# Altium project RcMPPT-SCC.PrjPcb
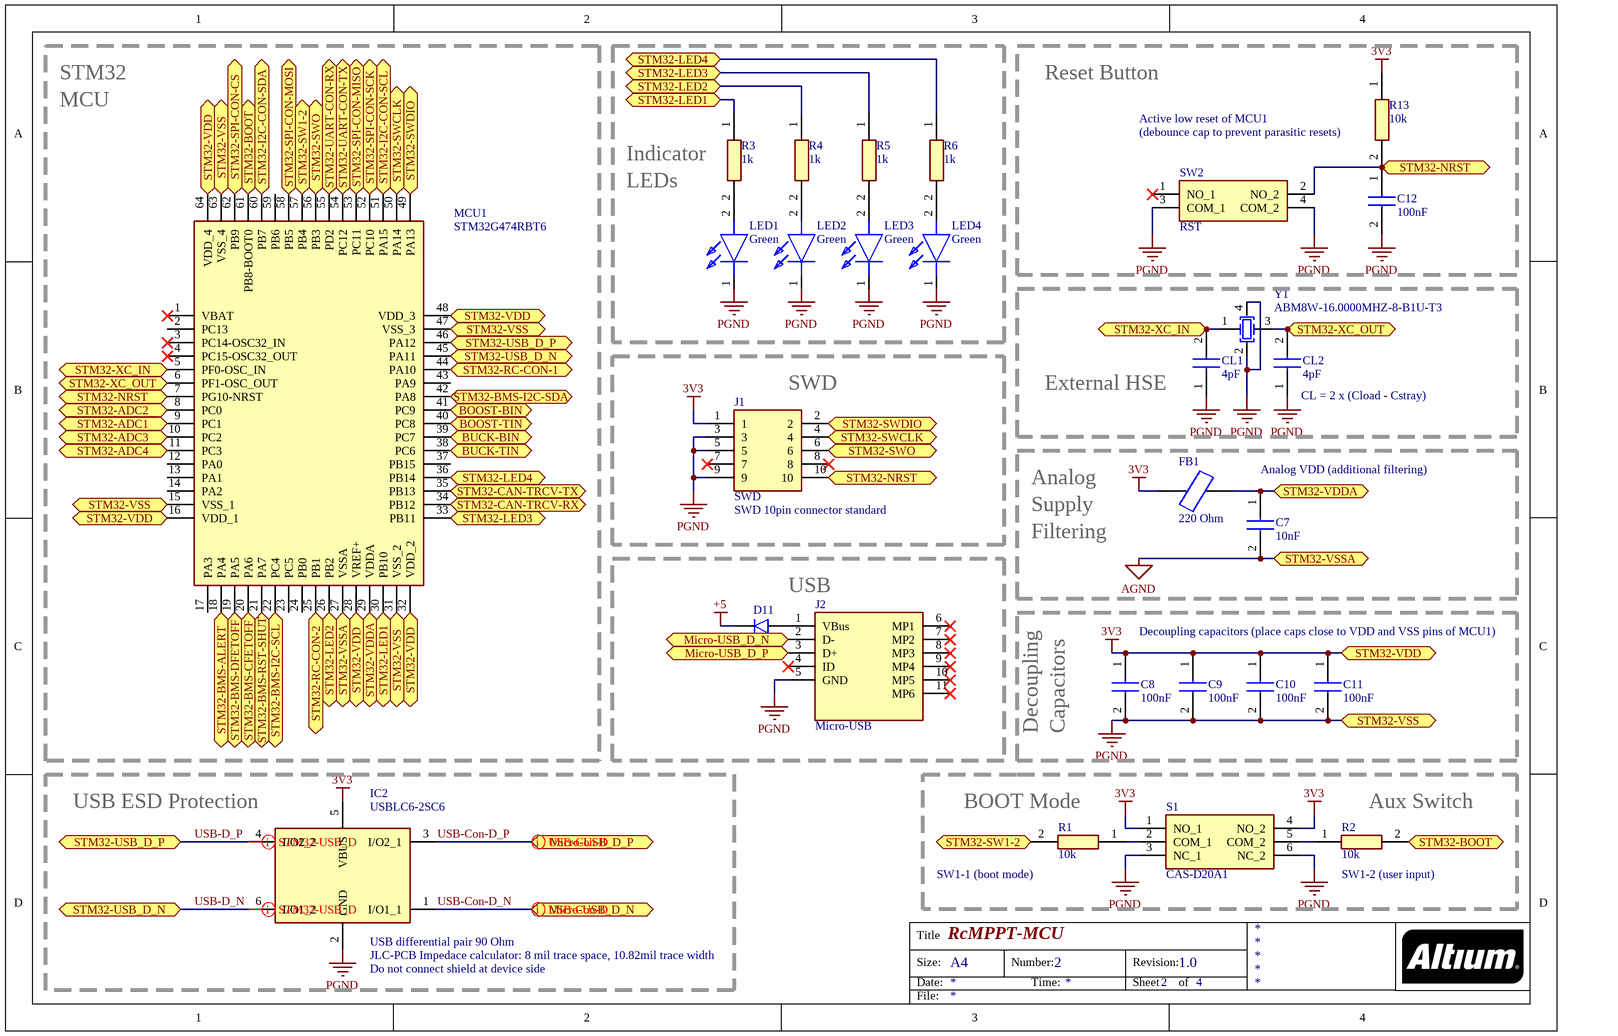
[diagram p0: RcMPPT-MCU.SchDoc]
4 sheets, 115 parts. Net scope: flat (ports and power ports of the same name join across sheets).
Board file: RcMPPT-SCC.PcbDoc
Sheets:
  RcMPPT-MCU.SchDoc
  RcMPPT-Power_Module.SchDoc
  RcMPPT-DCDC.SchDoc
  RcMPPT-IO.SchDoc

## Sheet RcMPPT-MCU.SchDoc: RcMPPT-MCU
size A4; Author: Thomas Hofmann; DocumentNumber: 2; Revision: 1.0; SheetNumber: 2; SheetTotal: 4

### Parts
C7  10nF  [CAPC2012X88N]
C8  100nF  [CAPC1608X97N]
C9  100nF  [CAPC1608X97N]
C10  100nF  [CAPC1608X97N]
C11  100nF  [CAPC1608X97N]
C12  100nF  [CAPC1608X97N]
CL1  4pF  [CAPC1608X90N]
CL2  4pF  [CAPC1608X90N]
D11  BAS3010A03WE6327HTSA1  [SOD2513X110N]  (value not drawn)
FB1  220 Ohm  [BEADC1608X75N]
IC2  USBLC6-2SC6  [SOT95P280X145-6N]
J1  SWD  [HUSSP10W40P127_2X5_635X340X420P]
J2  Micro-USB  [19815841]
LED1  Green  [LGQ396PS35]
LED2  Green  [LGQ396PS35]
LED3  Green  [LGQ396PS35]
LED4  Green  [LGQ396PS35]
MCU1  STM32G474RBT6  [QFP50P1200X1200X160-64N]
R1  10k  [RESC1608X55N]
R2  10k  [RESC1608X55N]
R3  1k  [RESC1608X55N]
R4  1k  [RESC1608X55N]
R5  1k  [RESC1608X55N]
R6  1k  [RESC1608X55N]
R13  10k  [RESC1608X55N]
S1  CAS-D20A1  [CASD20A1]
SW2  RST  [PTS647SK38SMTR2LFS]
Y1  ABM8W-16.0000MHZ-8-B1U-T3  [ABM8W160000MHZ8B1UT3]

### Blocks framed on the sheet
Reset Button: C12 R13 SW2
External HSE: CL1 CL2 Y1
SWD: J1
USB: D11 J2
USB ESD Protection: IC2

### Ports
BOOST-BIN (bidir), BOOST-TIN (bidir), BUCK-BIN (bidir), BUCK-TIN (bidir), Micro-USB_D_N (bidir), Micro-USB_D_P (bidir), STM32-ADC1 (bidir), STM32-ADC2 (bidir), STM32-ADC3 (bidir), STM32-ADC4 (bidir), STM32-BMS-ALERT (bidir), STM32-BMS-CFETOFF (bidir), STM32-BMS-DFETOFF (bidir), STM32-BMS-I2C-SCL (bidir), STM32-BMS-I2C-SDA (bidir), STM32-BMS-RST-SHUT (bidir), STM32-BOOT (bidir), STM32-CAN-TRCV-RX (bidir), STM32-CAN-TRCV-TX (bidir), STM32-I2C-CON-SCL (bidir), STM32-I2C-CON-SDA (bidir), STM32-LED1 (bidir), STM32-LED2 (bidir), STM32-LED3 (bidir), STM32-LED4 (bidir), STM32-NRST (bidir), STM32-RC-CON-1 (bidir), STM32-RC-CON-2 (bidir), STM32-SPI-CON-CS (bidir), STM32-SPI-CON-MISO (bidir), STM32-SPI-CON-MOSI (bidir), STM32-SPI-CON-SCK (bidir), STM32-SW1-2 (bidir), STM32-SWCLK (bidir), STM32-SWDIO (bidir), STM32-SWO (bidir), STM32-UART-CON-RX (bidir), STM32-UART-CON-TX (bidir), STM32-USB_D_N (bidir), STM32-USB_D_P (bidir), STM32-VDD (bidir), STM32-VDDA (bidir), STM32-VSS (bidir), STM32-VSSA (bidir), STM32-XC_IN (bidir), STM32-XC_OUT (bidir)

### Nets
3V3: C8.1 C9.1 C10.1 C11.1 FB1.1 IC2.5(VBUS) J1.1 MCU1.16(VDD_1) MCU1.28(VREF+) MCU1.32(VDD_2) MCU1.48(VDD_3) MCU1.64(VDD_4) R13.1 S1.1(NO_1) S1.4(NO_2) ; port STM32-VDD
+5: D11.1(K)
AGND: C7.2 MCU1.27(VSSA) ; port STM32-VSSA
PGND: C8.2 C9.2 C10.2 C11.2 C12.2 CL1.1 CL2.1 IC2.2(GND) J1.3 J1.5 J1.9 J2.5(GND) LED1.1(K) LED2.1(K) LED3.1(K) LED4.1(K) MCU1.15(VSS_1) MCU1.31(VSS_2) MCU1.47(VSS_3) MCU1.63(VSS_4) S1.3(NC_1) S1.6(NC_2) SW2.3(COM_1) SW2.4(COM_2) Y1.2(OSC2) Y1.4 ; port STM32-VSS
BOOST-BIN: MCU1.41(PC9) ; port BOOST-BIN
BOOST-TIN: MCU1.40(PC8) ; port BOOST-TIN
BUCK-BIN: MCU1.39(PC7) ; port BUCK-BIN
BUCK-TIN: MCU1.38(PC6) ; port BUCK-TIN
STM32-ADC1: MCU1.9(PC1) ; port STM32-ADC1
STM32-ADC2: MCU1.8(PC0) ; port STM32-ADC2
STM32-ADC3: MCU1.10(PC2) ; port STM32-ADC3
STM32-ADC4: MCU1.11(PC3) ; port STM32-ADC4
STM32-BMS-ALERT: MCU1.18(PA4) ; port STM32-BMS-ALERT
STM32-BMS-CFETOFF: MCU1.20(PA6) ; port STM32-BMS-CFETOFF
STM32-BMS-DFETOFF: MCU1.19(PA5) ; port STM32-BMS-DFETOFF
STM32-BMS-I2C-SCL: MCU1.22(PC4) ; port STM32-BMS-I2C-SCL
STM32-BMS-I2C-SDA: MCU1.42(PA8) ; port STM32-BMS-I2C-SDA
STM32-BMS-RST-SHUT: MCU1.21(PA7) ; port STM32-BMS-RST-SHUT
STM32-BOOT: MCU1.61(PB8-BOOT0) R2.2 ; port STM32-BOOT
STM32-CAN-TRCV-RX: MCU1.34(PB12) ; port STM32-CAN-TRCV-RX
STM32-CAN-TRCV-TX: MCU1.35(PB13) ; port STM32-CAN-TRCV-TX
STM32-I2C-CON-SCL: MCU1.51(PA15) ; port STM32-I2C-CON-SCL
STM32-I2C-CON-SDA: MCU1.60(PB7) ; port STM32-I2C-CON-SDA
STM32-LED1: MCU1.30(PB10) R3.1 ; port STM32-LED1
STM32-LED2: MCU1.26(PB2) R4.1 ; port STM32-LED2
STM32-LED3: MCU1.33(PB11) R5.1 ; port STM32-LED3
STM32-LED4: MCU1.36(PB14) R6.1 ; port STM32-LED4
STM32-NRST: C12.1 J1.10 MCU1.7(PG10-NRST) R13.2 SW2.2(NO_2) ; port STM32-NRST
STM32-RC-CON-1: MCU1.44(PA10) ; port STM32-RC-CON-1
STM32-RC-CON-2: MCU1.25(PB1) ; port STM32-RC-CON-2
STM32-SPI-CON-CS: MCU1.62(PB9) ; port STM32-SPI-CON-CS
STM32-SPI-CON-MISO: MCU1.53(PC11) ; port STM32-SPI-CON-MISO
STM32-SPI-CON-MOSI: MCU1.58(PB5) ; port STM32-SPI-CON-MOSI
STM32-SPI-CON-SCK: MCU1.52(PC10) ; port STM32-SPI-CON-SCK
STM32-SW1-2: MCU1.57(PB4) R1.2 ; port STM32-SW1-2
STM32-SWCLK: J1.4 MCU1.50(PA14) ; port STM32-SWCLK
STM32-SWDIO: J1.2 MCU1.49(PA13) ; port STM32-SWDIO
STM32-SWO: J1.6 MCU1.56(PB3) ; port STM32-SWO
STM32-UART-CON-RX: MCU1.55(PD2) ; port STM32-UART-CON-RX
STM32-UART-CON-TX: MCU1.54(PC12) ; port STM32-UART-CON-TX
STM32-VDDA: C7.1 FB1.2 MCU1.29(VDDA) ; port STM32-VDDA
STM32-XC_IN: CL1.2 MCU1.5(PF0-OSC_IN) Y1.1(OSC1) ; port STM32-XC_IN
STM32-XC_OUT: CL2.2 MCU1.6(PF1-OSC_OUT) Y1.3 ; port STM32-XC_OUT
USB-Con-D_N: IC2.1(I/O1_1) J2.2(D-) ; port Micro-USB_D_N
USB-Con-D_P: IC2.3(I/O2_1) J2.3(D+) ; port Micro-USB_D_P
USB-D_N: IC2.6(I/O1_2) MCU1.45(PA11) ; port STM32-USB_D_N
USB-D_P: IC2.4(I/O2_2) MCU1.46(PA12) ; port STM32-USB_D_P
NetD11_2: D11.2(A) J2.1(VBus)
NetLED1_2: LED1.2(A) R3.2
NetLED2_2: LED2.2(A) R4.2
NetLED3_2: LED3.2(A) R5.2
NetLED4_2: LED4.2(A) R6.2
NetR1_1: R1.1 S1.2(COM_1)
NetR2_1: R2.1 S1.5(COM_2)

Not connected (* = marked no-connect by the designer): J1 7* 8*; J2 4(ID)* 6(MP1)* 7(MP2)* 8(MP3)* 9(MP4)* 10(MP5)* 11(MP6)*; MCU1 1(VBAT)* 2(PC13) 3(PC14-OSC32_IN)* 4(PC15-OSC32_OUT)* 12(PA0) 13(PA1) 14(PA2) 17(PA3) 23(PC5) 24(PB0) 37(PB15) 43(PA9) 59(PB6); SW2 1(NO_1)*

### Layout directives
differential pair; rule Differential Pairs Routing [Pref Gap = 10mil    Min Gap  = 8mil    Max Gap  = 10milPref Width = 15mil    Min Width  = 10.28mil    Max Width  = 15mil]: USB-Con-D_N, USB-Con-D_P, USB-D_N, USB-D_P

### Notes on the sheet
- STM32
- MCU
- (near R3) Indicator
- Active low reset of MCU1
- (near R13) (debounce cap to prevent parasitic resets)
- LEDs
- (near CL2) CL = 2 x (Cload - Cstray)
- (near J1) SWD 10pin connector standard
- Analog
- Supply
- Analog VDD (additional filtering)
- Filtering
- Decoupling capacitors (place caps close to VDD and VSS pins of MCU1)
- Decoupling
- Capacitors
- (near R1) BOOT Mode
- (near R2) Aux Switch
- (near R1) SW1-1 (boot mode)
- (near R2) SW1-2 (user input)
- (near IC2) USB differential pair 90 Ohm
- (near IC2) JLC-PCB Impedace calculator: 8 mil trace space, 10.82mil trace width
- (near IC2) Do not connect shield at device side
- Title
- Size:
- Date:
- A4
- Number:
- Time:
- Revision:
- Sheet
- of
- File:

### Library data of the parts
C7 = C0805C103J3GACTU: Capacitor; Manufacturer_Name: Kemet; Datasheet Link: https://componentsearchengine.com/Datasheets/2/C0805C103J3GACTU.pdf; Height: 0.88mm; Manufacturer_Part_Number: C0805C103J3GACTU; Arrow Part Number: C0805C103J3GACTU; Arrow Price/Stock: https://www.arrow.com/en/products/c0805c103j3gactu/kemet-corporation; Mouser Part Number: 80-C0805C103J3G; Mouser Price/Stock: https://www.mouser.co.uk/ProductDetail/KEMET/C0805C103J3GACTU?qs=K%2Fj%2Fqf%252B0fqJFcB%2FiaHub0Q%3D%3D
C8-C12 = VJ0603Y104JXJAC: Capacitor; Manufacturer_Name: Vishay; Datasheet Link: http://www.vishay.com/docs/45226/vj31xrohsautomlcc.pdf; Height: 0.97mm; Manufacturer_Part_Number: VJ0603Y104JXJAC; Mouser Part Number: 77-VJ0603Y104JXJAC; Mouser Price/Stock: https://www.mouser.com/Search/Refine.aspx?Keyword=77-VJ0603Y104JXJAC
CL1 CL2 = CL10C040CB8NNNC: Capacitor; Manufacturer_Name: Samsung Electro-Mechanics; Datasheet Link: https://datasheet.lcsc.com/szlcsc/Samsung-Electro-Mechanics-CL10C040CB8NNNC_C307494.pdf; Height: 0.9mm; Manufacturer_Part_Number: CL10C040CB8NNNC; Mouser Part Number: N/A; Mouser Price/Stock: https://www.mouser.co.uk/ProductDetail/Samsung-Electro-Mechanics/CL10C040CB8NNNC?qs=X6jEic%2FHinCXvSxHicvHqA%3D%3D; Arrow Part Number: CL10C040CB8NNNC; Arrow Price/Stock: https://www.arrow.com/en/products/cl10c040cb8nnnc/samsung-electro-mechanics
D11 = BAS3010A03WE6327HTSA1: Diode; Manufacturer_Name: Infineon; Datasheet Link: https://www.infineon.com/dgdl/Infineon-BAS3010ASERIES-DS-v01_01-en.pdf?fileId=db3a30431ddc9372011dfbc50f231c06; Height: 1.1mm; Manufacturer_Part_Number: BAS3010A03WE6327HTSA1; Arrow Part Number: BAS3010A03WE6327HTSA1; Arrow Price/Stock: https://www.arrow.com/en/products/bas3010a03we6327htsa1/infineon-technologies-ag; Mouser Part Number: 726-BAS3010A-03WE6; Mouser Price/Stock: https://www.mouser.co.uk/ProductDetail/Infineon-Technologies/BAS3010A03WE6327HTSA1?qs=K00xGehIljtEbk1%252B2pLZ%252BQ%3D%3D
FB1 = MPZ1608S221ATA00: Ferrite Bead; Manufacturer_Name: TDK; Datasheet Link: https://product.tdk.com/info/en/catalog/datasheets/beads_commercial_power_mpz1608_en.pdf; Height: 0.75mm; Manufacturer_Part_Number: MPZ1608S221ATA00; Mouser Part Number: 810-MPZ1608S221ATA00; Mouser Price/Stock: https://www.mouser.co.uk/ProductDetail/TDK/MPZ1608S221ATA00/?qs=pLY5GE0xrmLZeKkazChaNg%3D%3D; Arrow Part Number: MPZ1608S221ATA00; Arrow Price/Stock: https://www.arrow.com/en/products/mpz1608s221ata00/tdk
IC2 = USBLC6-2SC6: Integrated Circuit; Manufacturer_Name: STMicroelectronics; Datasheet Link: http://www.st.com/st-web-ui/static/active/en/resource/technical/document/datasheet/CD00050750.pdf; Height: 1.45mm; Manufacturer_Part_Number: USBLC6-2SC6; Arrow Part Number: USBLC6-2SC6; Arrow Price/Stock: https://www.arrow.com/en/products/usblc6-2sc6/stmicroelectronics; Mouser Part Number: 511-USBLC6-2SC6; Mouser Price/Stock: https://www.mouser.co.uk/ProductDetail/STMicroelectronics/USBLC6-2SC6?qs=po45yt2pPpu%2FhNIlwQdTlg%3D%3D
J1 = M50-3600542R: Connector; Manufacturer_Name: Harwin; Datasheet Link: https://cdn.harwin.com/pdfs/M50-360R.pdf; Manufacturer_Part_Number: M50-3600542R; Mouser Part Number: 855-M50-3600542R; Mouser Price/Stock: https://www.mouser.co.uk/ProductDetail/Harwin/M50-3600542R?qs=DVxm2sPGGrrPu%2FxuhpV3yw%3D%3D
J2 = 1981584-1: Connector; Manufacturer_Name: TE Connectivity; Datasheet Link: http://www.te.com/commerce/DocumentDelivery/DDEController?Action=showdoc&DocId=Customer+Drawing%7F1981584%7FD2%7Fpdf%7FEnglish%7FENG_CD_1981584_D2.pdf%7F1981584-1; Height: 3mm; Manufacturer_Part_Number: 1981584-1; Arrow Part Number: 1981584-1; Arrow Price/Stock: https://www.arrow.com/en/products/1981584-1/te-connectivity; Mouser Part Number: 571-1981584-1; Mouser Price/Stock: https://www.mouser.co.uk/ProductDetail/TE-Connectivity/1981584-1?qs=ozkTL%2FUej0TLYxjQLPnd2Q%3D%3D
LED1-LED4 = LG_Q396-PS-35: LED; Manufacturer_Name: OSRAM; Manufacturer_Part_Number: LG Q396-PS-35; Datasheet Link: https://mouser.componentsearchengine.com/Datasheets/2/LG%20Q396-PS-35.pdf; Height: 0.4mm; Arrow Part Number: LG Q396-PS-35; Arrow Price/Stock: https://www.arrow.com/en/products/lgq396-ps-35/osram-opto-semiconductors; Mouser Part Number: 720-LGQ396A3964; Mouser Price/Stock: https://www.mouser.co.uk/ProductDetail/OSRAM-Opto-Semiconductors/LG-Q396-PS-35?qs=xC%252BE9h5iuX5%252BCocujXxOpw%3D%3D
MCU1 = STM32G474RBT6: Integrated Circuit; Manufacturer_Name: STMicroelectronics; Datasheet Link: https://www.mouser.com/datasheet/2/389/stm32g474cb-1600828.pdf; Height: 1.6mm; Manufacturer_Part_Number: STM32G474RBT6; Mouser Part Number: 511-STM32G474RBT6; Mouser Price/Stock: https://www.mouser.co.uk/ProductDetail/STMicroelectronics/STM32G474RBT6?qs=uwxL4vQweFP0uAZUZXLBhQ%3D%3D
R1 R2 R13 = MCT06030C1002FP500: Resistor; Manufacturer_Name: Vishay; Datasheet Link: http://www.vishay.com/docs/28705/mcx0x0xpro.pdf; Height: 0.55mm; Manufacturer_Part_Number: MCT06030C1002FP500; Mouser Part Number: 594-MCT06030C1002FP5; Mouser Price/Stock: https://www.mouser.co.uk/ProductDetail/Vishay-Beyschlag/MCT06030C1002FP500?qs=Wvg1umJc15zoHgIjwqoGHw%3D%3D
R3-R6 = MCT06030C1001FP500: Resistor; Manufacturer_Name: Vishay; Datasheet Link: http://www.vishay.com/docs/28705/mcx0x0xpro.pdf; Height: 0.55mm; Manufacturer_Part_Number: MCT06030C1001FP500; Mouser Part Number: 594-MCT06030C1001FP5; Mouser Price/Stock: https://www.mouser.co.uk/ProductDetail/Vishay-Beyschlag/MCT06030C1001FP500?qs=7ZE6F4QMOBbsjeUdqW8cwA%3D%3D
S1 = CAS-D20A1: Switch; Manufacturer_Name: Copal Electronics; Datasheet Link: https://www.nidec-copal-electronics.com/e/catalog/switch/cas.pdf; Height: 2.5mm; Manufacturer_Part_Number: CAS-D20A1
SW2 = PTS_647_SK38_SMTR2_LFS: Switch; Manufacturer_Name: C & K COMPONENTS; Manufacturer_Part_Number: PTS 647 SK38 SMTR2 LFS; Datasheet Link: https://dznh3ojzb2azq.cloudfront.net/products/Tactile/PTS647/documents/datasheet.pdf; Height: 3.8mm; Arrow Part Number: PTS 647 SK38 SMTR2 LFS; Arrow Price/Stock: https://www.arrow.com/en/products/pts-647-sk38-smtr2-lfs/ck
Y1 = ABM8W-16.0000MHZ-8-B1U-T3: Crystal or Oscillator; Manufacturer_Name: ABRACON; Datasheet Link: https://abracon.com/Resonators/ABM8W.pdf; Height: 0.75mm; Manufacturer_Part_Number: ABM8W-16.0000MHZ-8-B1U-T3; Mouser Part Number: 815-8W16-8B1UT; Mouser Price/Stock: https://www.mouser.co.uk/ProductDetail/ABRACON/ABM8W-160000MHZ-8-B1U-T3?qs=5aG0NVq1C4zuwTHNFUIcqw%3D%3D; Arrow Part Number: ABM8W-16.0000MHZ-8-B1U-T3; Arrow Price/Stock: https://www.arrow.com/en/products/abm8w-16.0000mhz-8-b1u-t3/abracon

## Sheet RcMPPT-Power_Module.SchDoc: RcMPPT-Power_Module
size A4; Author: Thomas Hofmann; DocumentNumber: 1; Revision: 1.0; SheetNumber: 1; SheetTotal: 4
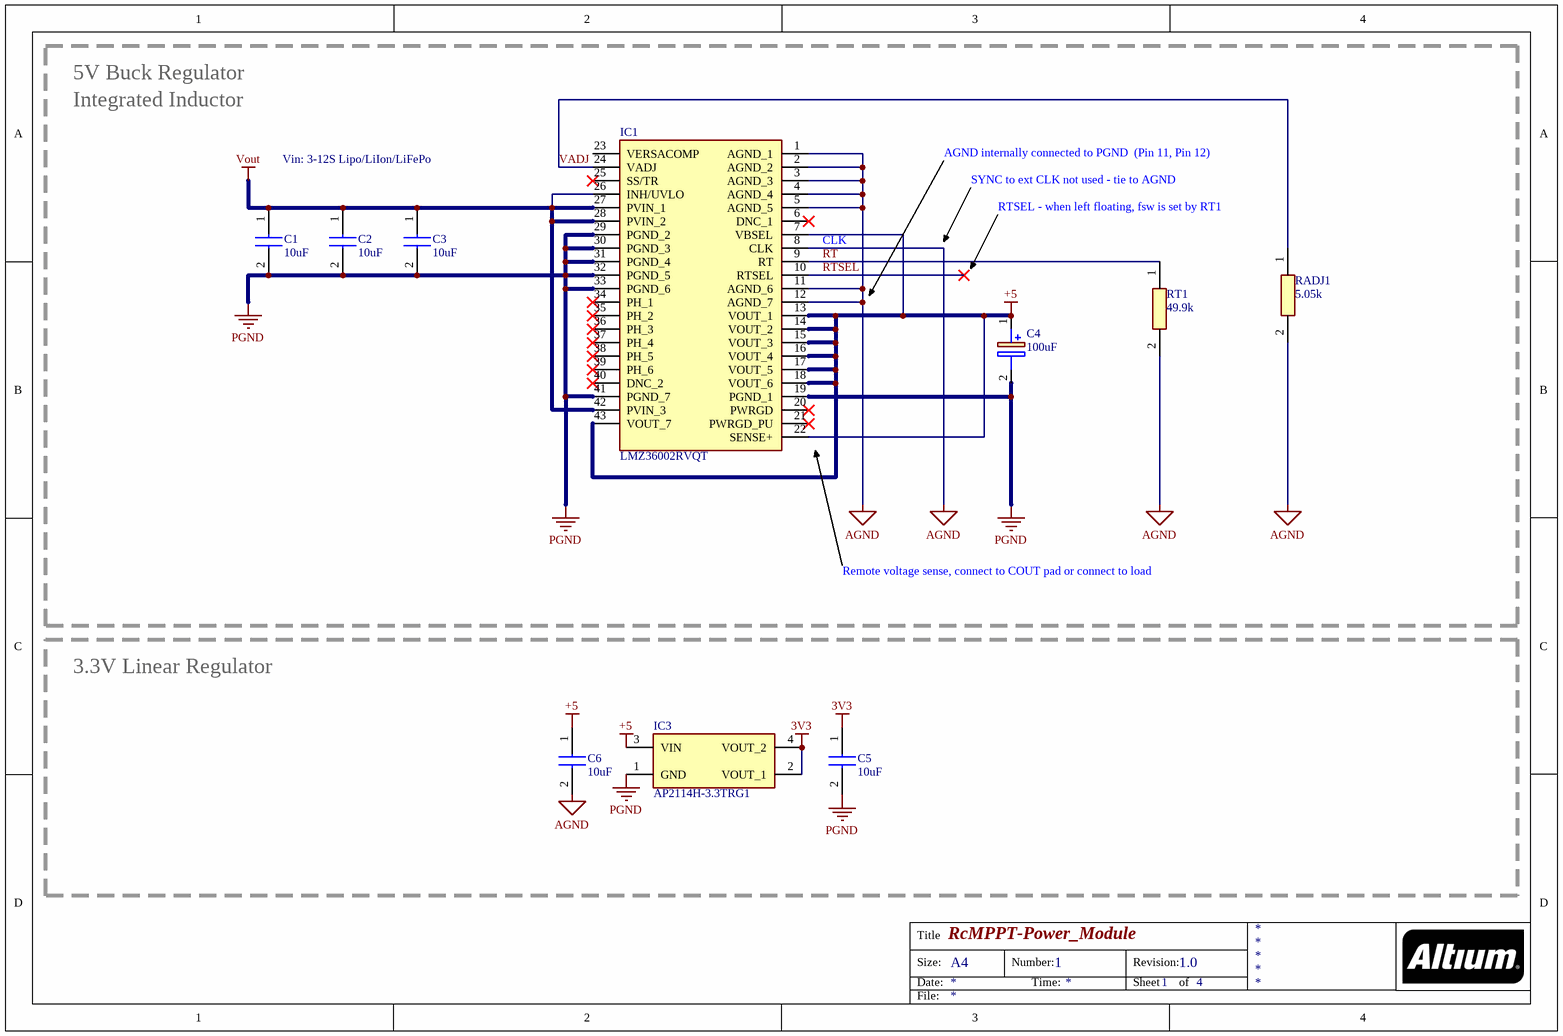
[diagram p1: RcMPPT-Power_Module.SchDoc]

### Parts
C1  10uF  [CAPC3225X280N]
C2  10uF  [CAPC3225X280N]
C3  10uF  [CAPC3225X280N]
C4  100uF  [CAPPM3528X200N]
C5  10uF  [CAPC3225X280N]
C6  10uF  [CAPC3225X280N]
IC1  LMZ36002RVQT  [LMZ36002RVQR]
IC3  AP2114H-3.3TRG1  [SOT230P700X180-4N]
RADJ1  5.05k  [R0805]
RT1  49.9k  [R0805]

### Blocks framed on the sheet
3.3V Linear Regulator: C5 C6 IC3

### Nets
3V3: C5.1 IC3.2(VOUT_1) IC3.4(VOUT_2)
+5: C4.1(+) C6.1 IC1.7(VBSEL) IC1.13(VOUT_1) IC1.14(VOUT_2) IC1.15(VOUT_3) IC1.16(VOUT_4) IC1.17(VOUT_5) IC1.18(VOUT_6) IC1.22(SENSE+) IC1.43(VOUT_7) IC3.3(VIN)
AGND: C6.2 IC1.1(AGND_1) IC1.2(AGND_2) IC1.3(AGND_3) IC1.4(AGND_4) IC1.5(AGND_5) IC1.8(CLK) IC1.11(AGND_6) IC1.12(AGND_7) RADJ1.2 RT1.2
PGND: C1.2 C2.2 C3.2 C4.2(-) C5.2 IC1.19(PGND_1) IC1.29(PGND_2) IC1.30(PGND_3) IC1.31(PGND_4) IC1.32(PGND_5) IC1.33(PGND_6) IC1.41(PGND_7) IC3.1(GND)
Vout: C1.1 C2.1 C3.1 IC1.26(INH/UVLO) IC1.27(PVIN_1) IC1.28(PVIN_2) IC1.42(PVIN_3)
RT: IC1.9(RT) RT1.1
RTSEL: IC1.10(RTSEL)
VADJ: IC1.24(VADJ) RADJ1.1

Not connected (* = marked no-connect by the designer): IC1 6(DNC_1)* 20(PWRGD)* 21(PWRGD_PU)* 23(VERSACOMP) 25(SS/TR)* 34(PH_1)* 35(PH_2)* 36(PH_3)* 37(PH_4)* 38(PH_5)* 39(PH_6)* 40(DNC_2)*

### Notes on the sheet
- 5V Buck Regulator
- Integrated Inductor
- Vin: 3-12S Lipo/LiIon/LiFePo
- AGND internally connected to PGND  (Pin 11, Pin 12)
- (near IC1) CLK
- SYNC to ext CLK not used - tie to AGND
- RTSEL - when left floating, fsw is set by RT1
- Remote voltage sense, connect to COUT pad or connect to load
- Title
- Size:
- Date:
- A4
- Number:
- Time:
- Revision:
- Sheet
- of
- File:

### Library data of the parts
C1-C3 C5 C6 = CL32B106KMVNNWE: Capacitor; Manufacturer_Name: Samsung Electro-Mechanics; Datasheet Link: https://www.arrow.com/en/products/cl32b106kmvnnwe/samsung-electro-mechanics; Height: 2.8mm; Manufacturer_Part_Number: CL32B106KMVNNWE; Arrow Part Number: CL32B106KMVNNWE; Arrow Price/Stock: https://www.arrow.com/en/products/cl32b106kmvnnwe/samsung-electro-mechanics; Mouser Part Number: N/A; Mouser Price/Stock: https://www.mouser.co.uk/ProductDetail/Samsung-Electro-Mechanics/CL32B106KMVNNWE?qs=xZ%2FP%252Ba9zWqaEMBbSgKy8gQ%3D%3D
C4 = 8TPE100MAZB: Capacitor Polarised; Manufacturer_Name: Panasonic; Datasheet Link: http://uk.rs-online.com/web/p/products/7887374; Height: 2mm; Manufacturer_Part_Number: 8TPE100MAZB; Arrow Part Number: 8TPE100MAZB; Arrow Price/Stock: https://www.arrow.com/en/products/8tpe100mazb/panasonic; Mouser Part Number: 667-8TPE100MAZB; Mouser Price/Stock: https://www.mouser.co.uk/ProductDetail/Panasonic/8TPE100MAZB?qs=OE1iw1LrrPHKTwwfsidxgA%3D%3D
IC1 = LMZ36002RVQT: Integrated Circuit; Manufacturer_Name: Texas Instruments; Datasheet Link: http://www.ti.com/lit/gpn/lmz36002; Height: 2.13mm; Manufacturer_Part_Number: LMZ36002RVQT; Arrow Part Number: LMZ36002RVQT; Arrow Price/Stock: https://www.arrow.com/en/products/lmz36002rvqt/texas-instruments; Mouser Part Number: 595-LMZ36002RVQT; Mouser Price/Stock: https://www.mouser.co.uk/ProductDetail/Texas-Instruments/LMZ36002RVQT?qs=kFLL9AfgRSBjXTxBMSjGOw%3D%3D
IC3 = AP2114H-3.3TRG1: Integrated Circuit; Manufacturer_Name: Diodes Inc.; Datasheet Link: http://uk.rs-online.com/web/p/products/8283528; Height: 1.8mm; Manufacturer_Part_Number: AP2114H-3.3TRG1; Arrow Part Number: AP2114H-3.3TRG1; Arrow Price/Stock: https://www.arrow.com/en/products/ap2114h-3.3trg1/diodes-incorporated; Mouser Part Number: 621-AP2114H-3.3TRG1; Mouser Price/Stock: https://www.mouser.co.uk/ProductDetail/Diodes-Incorporated/AP2114H-33TRG1?qs=x6A8l6qLYDDSG%2FfwzcsOhw%3D%3D
RADJ1 = RT0805BRD075K05L: Resistor; Manufacturer_Name: Yageo; Datasheet Link: https://www.mouser.at/datasheet/2/447/PYu-RT_1-to-0.01_RoHS_L_11-1669912.pdf; Height: 0.7mm; Manufacturer_Part_Number: RT0805BRD075K05L; Mouser Part Number: 603-RT0805BRD075K05L; Mouser Price/Stock: https://www.mouser.at/ProductDetail/Yageo/RT0805BRD075K05L?qs=bQfrgN9vNvwObDVrZ%2FDM5w%3D%3D
RT1 = ERJ-6ENF4992V: Resistor; Manufacturer_Name: Panasonic; Datasheet Link: https://industrial.panasonic.com/cdbs/www-data/pdf/RDA0000/AOA0000C84.pdf; Height: 0.7mm; Manufacturer_Part_Number: ERJ-6ENF4992V; Mouser Part Number: 667-ERJ-6ENF4992V; Mouser Price/Stock: https://www.mouser.com/Search/Refine.aspx?Keyword=667-ERJ-6ENF4992V

## Sheet RcMPPT-DCDC.SchDoc: RcMPPT-DCDC
size A4; Author: Thomas Hofmann; Address2: HTBLuVA St. Pölten; Address3: Thomas Hofmann; DocumentNumber: 3; Revision: 1.0; SheetNumber: 3; SheetTotal: 4
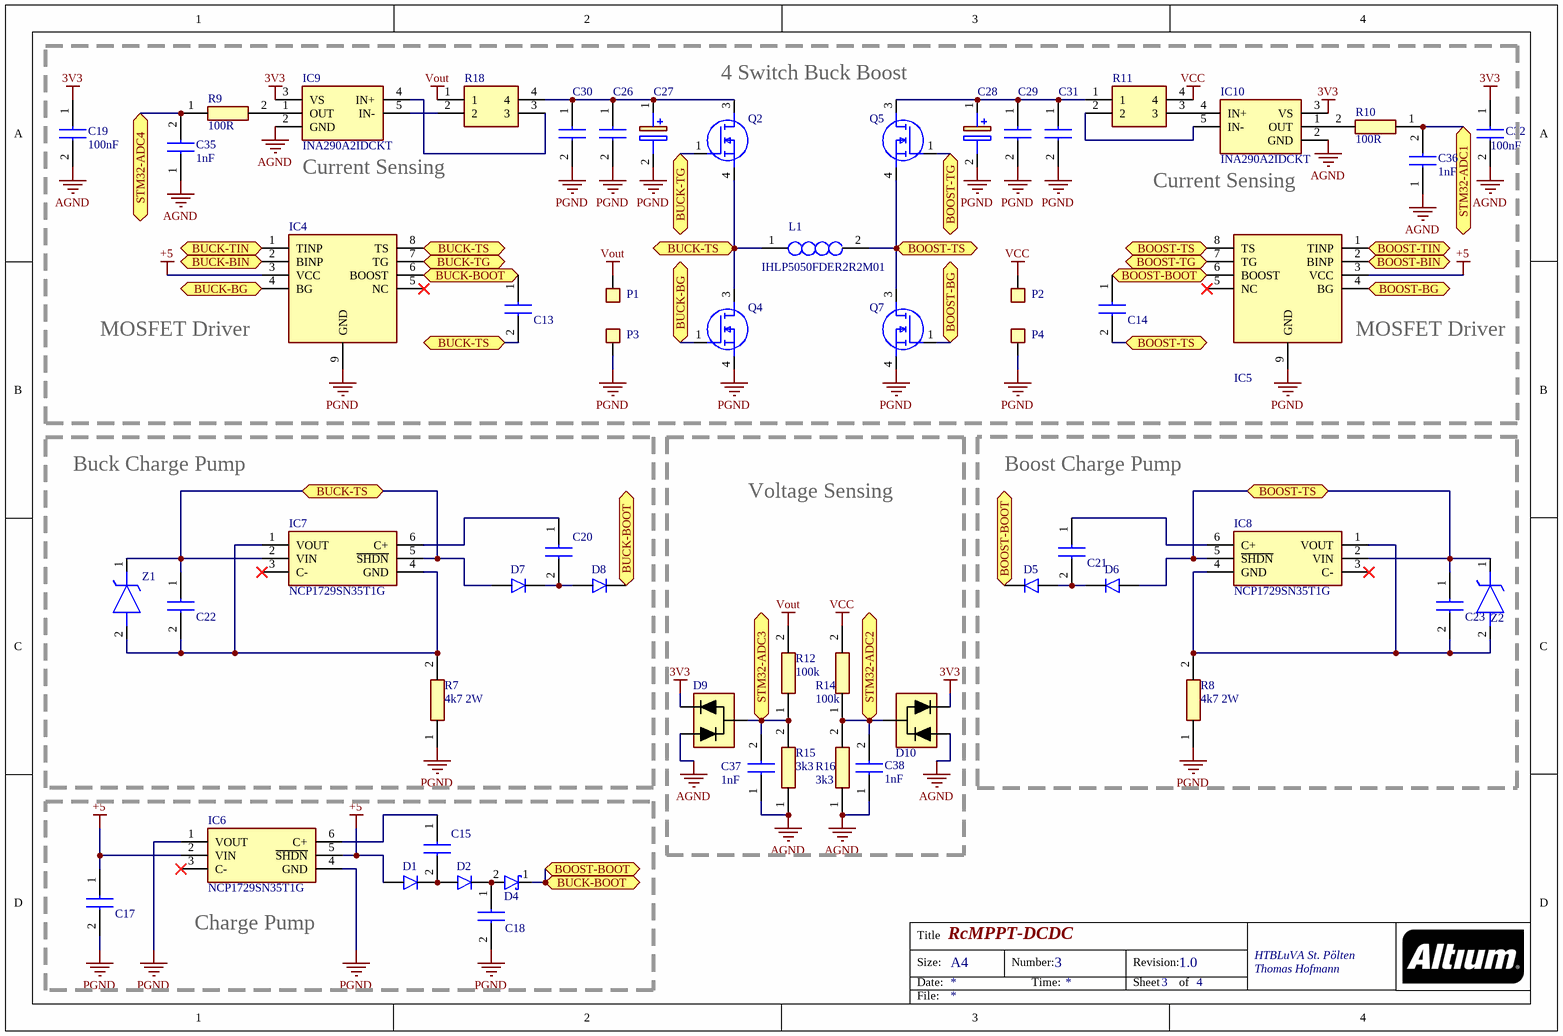
[diagram p2: RcMPPT-DCDC.SchDoc]

### Parts
C13  C1608X5R1E335K080AC  [CAPC1608X90N]  (value not drawn)
C14  C1608X5R1E335K080AC  [CAPC1608X90N]  (value not drawn)
C15  C1608X5R1E335K080AC  [CAPC1608X90N]  (value not drawn)
C17  C1608X5R1E335K080AC  [CAPC1608X90N]  (value not drawn)
C18  C1608X5R1E335K080AC  [CAPC1608X90N]  (value not drawn)
C19  100nF  [CAPC1608X97N]
C20  C1608X5R1E335K080AC  [CAPC1608X90N]  (value not drawn)
C21  C1608X5R1E335K080AC  [CAPC1608X90N]  (value not drawn)
C22  C1608X5R1E335K080AC  [CAPC1608X90N]  (value not drawn)
C23  C1608X5R1E335K080AC  [CAPC1608X90N]  (value not drawn)
C26  GRM32EC72A106KE05L  [CAPC3225X270N]  (value not drawn)
C27  UUX2A470MNL1GS  [CAPAE1030X1050N]  (value not drawn)
C28  UUX2A470MNL1GS  [CAPAE1030X1050N]  (value not drawn)
C29  GRM32EC72A106KE05L  [CAPC3225X270N]  (value not drawn)
C30  GRM32EC72A106KE05L  [CAPC3225X270N]  (value not drawn)
C31  GRM32EC72A106KE05L  [CAPC3225X270N]  (value not drawn)
C32  100nF  [CAPC1608X97N]
C35  1nF  [CAPC1608X90N]
C36  1nF  [CAPC1608X90N]
C37  1nF  [CAPC1608X90N]
C38  1nF  [CAPC1608X90N]
D1  BAS3010A03WE6327HTSA1  [SOD2513X110N]  (value not drawn)
D2  BAS3010A03WE6327HTSA1  [SOD2513X110N]  (value not drawn)
D4  V8PAM10S-M3_H  [V8PAM10SHM3H]  (value not drawn)
D5  BAS3010A03WE6327HTSA1  [SOD2513X110N]  (value not drawn)
D6  BAS3010A03WE6327HTSA1  [SOD2513X110N]  (value not drawn)
D7  BAS3010A03WE6327HTSA1  [SOD2513X110N]  (value not drawn)
D8  BAS3010A03WE6327HTSA1  [SOD2513X110N]  (value not drawn)
D9  BAT54SQ-7-F  [SOT96P240X110-3N]  (value not drawn)
D10  BAT54SQ-7-F  [SOT96P240X110-3N]  (value not drawn)
IC4  LTC4444EMS8E-5#PBF  [SOP65P490X110-9N]  (value not drawn)
IC5  LTC4444EMS8E-5#PBF  [SOP65P490X110-9N]  (value not drawn)
IC6  NCP1729SN35T1G  [SOT105P275X110-6N]
IC7  NCP1729SN35T1G  [SOT105P275X110-6N]
IC8  NCP1729SN35T1G  [SOT105P275X110-6N]
IC9  INA290A2IDCKT  [SOT65P210X110-5N]
IC10  INA290A2IDCKT  [SOT65P210X110-5N]
L1  IHLP5050FDER2R2M01  [INDPM132129X650N]
P1  PowerPad  [POWER_PAD]  (value not drawn)
P2  PowerPad  [POWER_PAD]  (value not drawn)
P3  PowerPad  [POWER_PAD]  (value not drawn)
P4  PowerPad  [POWER_PAD]  (value not drawn)
Q2  IPD90N10S4L06ATMA1  [IPD90N10S4L06ATMA1]  (value not drawn)
Q4  IPD90N10S4L06ATMA1  [IPD90N10S4L06ATMA1]  (value not drawn)
Q5  IPD90N10S4L06ATMA1  [IPD90N10S4L06ATMA1]  (value not drawn)
Q7  IPD90N10S4L06ATMA1  [IPD90N10S4L06ATMA1]  (value not drawn)
R7  4k7 2W  [RESC3263X80N]
R8  4k7 2W  [RESC3263X80N]
R9  100R  [RESC1608X55N]
R10  100R  [RESC1608X55N]
R11  WSK1216L5000FEA  [WSK12161L000FEA]  (value not drawn)
R12  100k  [RESC1608X55N]
R14  100k  [RESC1608X55N]
R15  3k3  [RESC1608X55N]
R16  3k3  [RESC1608X55N]
R18  WSK1216L5000FEA  [WSK12161L000FEA]  (value not drawn)
Z1  YFZVFHTR10B  [TDZVTR51]  (value not drawn)
Z2  YFZVFHTR10B  [TDZVTR51]  (value not drawn)

### Blocks framed on the sheet
Buck Charge Pump: C20 C22 D7 D8 IC7 R7 Z1
Voltage Sensing: C37 C38 D9 D10 R12 R14-R16
Boost Charge Pump: C21 C23 D5 D6 IC8 R8 Z2
Charge Pump: C15 C17 C18 D1 D2 D4 IC6

### Ports
BOOST-BG (bidir), BOOST-BIN (bidir), BOOST-BOOT (bidir), BOOST-TG (bidir), BOOST-TIN (bidir), BOOST-TS (bidir), BUCK-BG (bidir), BUCK-BIN (bidir), BUCK-BOOT (bidir), BUCK-TG (bidir), BUCK-TIN (bidir), BUCK-TS (bidir), STM32-ADC1 (bidir), STM32-ADC2 (bidir), STM32-ADC3 (bidir), STM32-ADC4 (bidir)

### Nets
3V3: C19.1 C32.1 D9.2(K) D10.2(K) IC9.3(VS) IC10.3(VS)
+5: C17.1 D1.2(A) IC4.3(VCC) IC5.3(VCC) IC6.2(VIN) IC6.5(~{SHDN})
AGND: C19.2 C32.2 C35.1 C36.1 C37.1 C38.1 D9.1(A) D10.1(A) IC9.2(GND) IC10.2(GND) R15.1 R16.1
PGND: C17.2 C18.2 C26.2 C27.2(-) C28.2(-) C29.2 C30.2 C31.2 IC4.9(GND) IC5.9(GND) IC6.1(VOUT) IC6.4(GND) P3.1 P4.1 Q4.4(S) Q7.4(S) R7.1 R8.1
VCC: P2.1 R11.4 R14.2
Vout: P1.1 R12.2 R18.1
BOOST-BG: IC5.4(BG) Q7.1(G) ; port BOOST-BG
BOOST-BIN: IC5.2(BINP) ; port BOOST-BIN
BOOST-BOOT: C13.1 C14.1 D4.1(K) D5.1(K) D8.1(K) IC4.6(BOOST) IC5.6(BOOST) ; port BOOST-BOOT, port BUCK-BOOT
BOOST-TG: IC5.7(TG) Q5.1(G) ; port BOOST-TG
BOOST-TIN: IC5.1(TINP) ; port BOOST-TIN
BOOST-TS: C14.2 C23.1 D6.2(A) IC5.8(TS) IC8.2(VIN) IC8.5(~{SHDN}) L1.2 Q5.4(S) Q7.3(D) Z2.1(K) ; port BOOST-TS
BUCK-BG: IC4.4(BG) Q4.1(G) ; port BUCK-BG
BUCK-BIN: IC4.2(BINP) ; port BUCK-BIN
BUCK-TG: IC4.7(TG) Q2.1(G) ; port BUCK-TG
BUCK-TIN: IC4.1(TINP) ; port BUCK-TIN
BUCK-TS: C13.2 C22.1 D7.2(A) IC4.8(TS) IC7.2(VIN) IC7.5(~{SHDN}) L1.1 Q2.4(S) Q4.3(D) Z1.1(K) ; port BUCK-TS
STM32-ADC1: C36.2 R10.1 ; port STM32-ADC1
STM32-ADC2: C38.2 D10.3(A/K) R14.1 R16.2 ; port STM32-ADC2
STM32-ADC3: C37.2 D9.3(A/K) R12.1 R15.2 ; port STM32-ADC3
STM32-ADC4: C35.2 R9.1 ; port STM32-ADC4
NetC15_1: C15.1 IC6.6(C+)
NetC15_2: C15.2 D1.1(K) D2.2(A)
NetC18_1: C18.1 D2.1(K) D4.2(A)
NetC20_1: C20.1 IC7.6(C+)
NetC20_2: C20.2 D7.1(K) D8.2(A)
NetC21_1: C21.1 IC8.6(C+)
NetC21_2: C21.2 D5.2(A) D6.1(K)
NetC22_2: C22.2 IC7.1(VOUT) IC7.4(GND) R7.2 Z1.2(A)
NetC23_2: C23.2 IC8.1(VOUT) IC8.4(GND) R8.2 Z2.2(A)
NetC26_1: C26.1 C27.1(+) C30.1 Q2.3(D) R18.4
NetC28_1: C28.1(+) C29.1 C31.1 Q5.3(D) R11.1
NetIC9_1: IC9.1(OUT) R9.2
NetIC9_4: IC9.4(IN+) R18.3
NetIC9_5: IC9.5(IN-) R18.2
NetIC10_1: IC10.1(OUT) R10.2
NetIC10_4: IC10.4(IN+) R11.3
NetIC10_5: IC10.5(IN-) R11.2

Not connected (* = marked no-connect by the designer): IC4 5(NC)*; IC5 5(NC)*; IC6 3(C-)*; IC7 3(C-)*; IC8 3(C-)*

### Notes on the sheet
- 4 Switch Buck Boost
- Current Sensing
- (near IC10) Current Sensing
- (near IC4) MOSFET Driver
- (near IC5) MOSFET Driver
- Title
- Size:
- Date:
- A4
- Number:
- Time:
- Revision:
- Sheet
- of
- File:

### Library data of the parts
C13-C15 C17 C18 C20-C23 = C1608X5R1E335K080AC: Capacitor; Manufacturer_Name: TDK; Datasheet Link: https://product.tdk.com/info/en/catalog/datasheets/mlcc_commercial_midvoltage_en.pdf; Height: 0.9mm; Manufacturer_Part_Number: C1608X5R1E335K080AC; Arrow Part Number: C1608X5R1E335K080AC; Arrow Price/Stock: https://www.arrow.com/en/products/c1608x5r1e335k080ac/tdk; Mouser Part Number: 810-C1608X5R1E335KAC; Mouser Price/Stock: https://www.mouser.com/Search/Refine.aspx?Keyword=810-C1608X5R1E335KAC
C19 C32 = VJ0603Y104JXJAC: Capacitor; Manufacturer_Name: Vishay; Datasheet Link: http://www.vishay.com/docs/45226/vj31xrohsautomlcc.pdf; Height: 0.97mm; Manufacturer_Part_Number: VJ0603Y104JXJAC; Mouser Part Number: 77-VJ0603Y104JXJAC; Mouser Price/Stock: https://www.mouser.com/Search/Refine.aspx?Keyword=77-VJ0603Y104JXJAC
C26 C29-C31 = GRM32EC72A106KE05L: Capacitor; Manufacturer_Name: Murata Electronics; Datasheet Link: http://psearch.en.murata.com/capacitor/product/GRM32ER71E226KE15%23.pdf; Height: 2.7mm; Manufacturer_Part_Number: GRM32EC72A106KE05L; Mouser Part Number: 81-GRM32EC72A106KE05; Mouser Price/Stock: https://www.mouser.co.uk/ProductDetail/Murata-Electronics/GRM32EC72A106KE05L?qs=5aG0NVq1C4yOgpL0%2FICNsw%3D%3D; Arrow Part Number: GRM32EC72A106KE05L; Arrow Price/Stock: https://www.arrow.com/en/products/grm32ec72a106ke05l/murata-manufacturing
C27 C28 = UUX2A470MNL1GS: Capacitor Polarised; Manufacturer_Name: Nichicon; Datasheet Link: https://componentsearchengine.com/Datasheets/1/UUX2A470MNL1GS.pdf; Height: 10.5mm; Manufacturer_Part_Number: UUX2A470MNL1GS; Mouser Part Number: 647-UUX2A470MNL1GS; Mouser Price/Stock: https://www.mouser.co.uk/ProductDetail/Nichicon/UUX2A470MNL1GS?qs=jZZh9D7uMhmPZMofMKn2Fg%3D%3D; Arrow Part Number: UUX2A470MNL1GS; Arrow Price/Stock: https://www.arrow.com/en/products/uux2a470mnl1gs/nichicon
C35-C38 = 06035A102JAT2A: Capacitor; Manufacturer_Name: AVX; Datasheet Link: http://datasheets.avx.com/C0GNP0-Dielectric.pdf; Height: 0.9mm; Manufacturer_Part_Number: 06035A102JAT2A; Mouser Part Number: 581-06035A102J; Mouser Price/Stock: https://www.mouser.co.uk/ProductDetail/AVX/06035A102JAT2A?qs=I5rfTV0A4wGLF2%252B95sWyMg%3D%3D; Arrow Part Number: 06035A102JAT2A; Arrow Price/Stock: https://www.arrow.com/en/products/06035a102jat2a/avx
D1 D2 D5-D8 = BAS3010A03WE6327HTSA1: Diode; Manufacturer_Name: Infineon; Datasheet Link: https://www.infineon.com/dgdl/Infineon-BAS3010ASERIES-DS-v01_01-en.pdf?fileId=db3a30431ddc9372011dfbc50f231c06; Height: 1.1mm; Manufacturer_Part_Number: BAS3010A03WE6327HTSA1; Arrow Part Number: BAS3010A03WE6327HTSA1; Arrow Price/Stock: https://www.arrow.com/en/products/bas3010a03we6327htsa1/infineon-technologies-ag; Mouser Part Number: 726-BAS3010A-03WE6; Mouser Price/Stock: https://www.mouser.co.uk/ProductDetail/Infineon-Technologies/BAS3010A03WE6327HTSA1?qs=K00xGehIljtEbk1%252B2pLZ%252BQ%3D%3D
D4 = V8PAM10S-M3_H: Schottky Diode; Manufacturer_Name: Vishay; Manufacturer_Part_Number: V8PAM10S-M3/H; Datasheet Link: https://www.vishay.com/docs/87013/v8pam10s.pdf; Height: 1mm; Mouser Part Number: 78-V8PAM10S-M3/H; Mouser Price/Stock: https://www.mouser.co.uk/ProductDetail/Vishay-General-Semiconductor/V8PAM10S-M3-H/?qs=7MVldsJ5Uazp%2FkF6tV7Ktw%3D%3D
D9 D10 = BAT54SQ-7-F: Schottky Diode; Manufacturer_Name: Diodes Inc.; Datasheet Link: https://www.arrow.com/en/products/bat54sq-7-f/diodes-incorporated; Height: 1.1mm; Manufacturer_Part_Number: BAT54SQ-7-F; Mouser Part Number: 621-BAT54SQ-7-F; Mouser Price/Stock: https://www.mouser.co.uk/ProductDetail/Diodes-Incorporated/BAT54SQ-7-F/?qs=vdQOMtKMWaAKaYcjx11stw%3D%3D; Arrow Part Number: BAT54SQ-7-F; Arrow Price/Stock: https://www.arrow.com/en/products/bat54sq-7-f/diodes-incorporated
IC4 IC5 = LTC4444EMS8E-5#PBF: Integrated Circuit; Manufacturer_Name: Linear Technology; Datasheet Link: http://www.linear.com/docs/26366; Height: 1.1mm; Manufacturer_Part_Number: LTC4444EMS8E-5#PBF; Arrow Part Number: LTC4444EMS8E-5#PBF; Arrow Price/Stock: https://www.arrow.com/en/products/ltc4444ems8e-5pbf/linear-technology; Mouser Part Number: 584-C4444EMS8E-5PBF; Mouser Price/Stock: https://www.mouser.com/Search/Refine.aspx?Keyword=584-C4444EMS8E-5PBF
IC6-IC8 = NCP1729SN35T1G: Integrated Circuit; Manufacturer_Name: ON Semiconductor; Datasheet Link: http://www.onsemi.com/pub/Collateral/NCP1729-D.PDF; Height: 1.1mm; Manufacturer_Part_Number: NCP1729SN35T1G; Arrow Part Number: NCP1729SN35T1G; Arrow Price/Stock: https://www.arrow.com/en/products/ncp1729sn35t1g/on-semiconductor; Mouser Part Number: 863-NCP1729SN35T1G; Mouser Price/Stock: https://www.mouser.co.uk/ProductDetail/ON-Semiconductor/NCP1729SN35T1G?qs=%2FugrpAKHX8pjfXPiRUErOw%3D%3D
IC9 IC10 = INA290A2IDCKT: Integrated Circuit; Manufacturer_Name: Texas Instruments; Datasheet Link: https://www.ti.com/lit/ds/symlink/ina290.pdf?ts=1605766072094&ref_url=https%253A%252F%252Fwww.ti.com%252Fstore%252Fti%252Fen%252Fp%252Fproduct%252F%253Fp%253DINA290A2IDCKT; Height: 1.1mm; Manufacturer_Part_Number: INA290A2IDCKT; Mouser Part Number: 595-INA290A2IDCKT; Mouser Price/Stock: https://www.mouser.co.uk/ProductDetail/Texas-Instruments/INA290A2IDCKT/?qs=sPbYRqrBIVkkx%2FoqcXF%2FVw%3D%3D
L1 = IHLP5050FDER2R2M01: Inductor; Manufacturer_Name: Vishay; Datasheet Link: http://uk.rs-online.com/web/p/products/7487448P; Height: 6.5mm; Manufacturer_Part_Number: IHLP5050FDER2R2M01; Mouser Part Number: 70-IHLP5050FDER2R2M1; Mouser Price/Stock: https://www.mouser.co.uk/ProductDetail/Vishay-Dale/IHLP5050FDER2R2M01?qs=bGpylJ3EYaCbgSSjAcbJVQ%3D%3D; Arrow Part Number: IHLP5050FDER2R2M01; Arrow Price/Stock: https://www.arrow.com/en/products/ihlp5050fder2r2m01/vishay
Q2 Q4 Q5 Q7 = IPD90N10S4L06ATMA1: MOSFET (N-Channel); Manufacturer_Name: Infineon; Datasheet Link: https://www.infineon.com/dgdl/Infineon-IPD90N10S4L_06-DS-v01_00-en.pdf?fileId=db3a3043372d5cc80137500063630512; Height: 2mm; Manufacturer_Part_Number: IPD90N10S4L06ATMA1; Arrow Part Number: IPD90N10S4L06ATMA1; Arrow Price/Stock: https://www.arrow.com/en/products/ipd90n10s4l06atma1/infineon-technologies-ag; Mouser Part Number: 726-IPD90N10S4L06ATM; Mouser Price/Stock: https://www.mouser.co.uk/ProductDetail/Infineon-Technologies/IPD90N10S4L06ATMA1?qs=LxJ0xX%2FWJR62lwU%2FrihEDA%3D%3D
R7 R8 = RCL12254K70FKEG: Resistor; Manufacturer_Name: Vishay; Datasheet Link: https://componentsearchengine.com/Datasheets/1/RCL12254K70FKEG.pdf; Height: 0.8mm; Manufacturer_Part_Number: RCL12254K70FKEG; Mouser Part Number: 71-RCL12254K70FKEG; Mouser Price/Stock: https://www.mouser.com/Search/Refine.aspx?Keyword=71-RCL12254K70FKEG
R9 R10 = ERJ-3EKF1000V: Resistor; Manufacturer_Name: Panasonic; Datasheet Link: http://industrial.panasonic.com/cdbs/www-data/pdf/RDA0000/AOA0000C86.pdf; Height: 0.55mm; Manufacturer_Part_Number: ERJ-3EKF1000V; Mouser Part Number: 667-ERJ-3EKF1000V; Mouser Price/Stock: https://www.mouser.co.uk/ProductDetail/Panasonic/ERJ-3EKF1000V/?qs=H7k1u0Mp9JS7i8KGO5m47A%3D%3D; Arrow Part Number: ERJ-3EKF1000V; Arrow Price/Stock: https://www.arrow.com/en/products/erj-3ekf1000v/panasonic
R11 R18 = WSK1216L5000FEA: Resistor; Manufacturer_Name: Vishay; Datasheet Link: http://www.vishay.com/docs/30189/wsk1216.pdf; Height: 1.9mm; Manufacturer_Part_Number: WSK1216L5000FEA
R12 R14 = ERJ-PA3J104V: Resistor; Manufacturer_Name: Panasonic; Datasheet Link: https://industrial.panasonic.com/cdbs/www-data/pdf/RDA0000/AOA0000C243.pdf; Height: 0.55mm; Manufacturer_Part_Number: ERJ-PA3J104V; Mouser Part Number: 667-ERJ-PA3J104V; Mouser Price/Stock: https://www.mouser.com/Search/Refine.aspx?Keyword=667-ERJ-PA3J104V; Arrow Part Number: ERJ-PA3J104V; Arrow Price/Stock: https://www.arrow.com/en/products/erj-pa3j104v/panasonic
R15 R16 = ERJ-PA3J332V: Resistor; Manufacturer_Name: Panasonic; Datasheet Link: https://industrial.panasonic.com/cdbs/www-data/pdf/RDO0000/AOA0000C331.pdf; Height: 0.55mm; Manufacturer_Part_Number: ERJ-PA3J332V; Mouser Part Number: 667-ERJ-PA3J332V; Mouser Price/Stock: https://www.mouser.co.uk/ProductDetail/Panasonic/ERJ-PA3J332V?qs=BzJM0faLVqUb4RD3AQ1dMg%3D%3D
Z1 Z2 = YFZVFHTR10B: Zener Diode; Manufacturer_Name: ROHM Semiconductor; Datasheet Link: http://rohmfs.rohm.com/en/products/databook/datasheet/discrete/diode/zener/yfzvfhtr10b-e.pdf; Height: 0.8mm; Manufacturer_Part_Number: YFZVFHTR10B; Mouser Part Number: 755-YFZVFHTR10B; Mouser Price/Stock: https://www.mouser.com/Search/Refine.aspx?Keyword=755-YFZVFHTR10B

## Sheet RcMPPT-IO.SchDoc: RcMPPT-IO
size A4; DocumentNumber: 4; Revision: 1.0; SheetNumber: 4; SheetTotal: 4
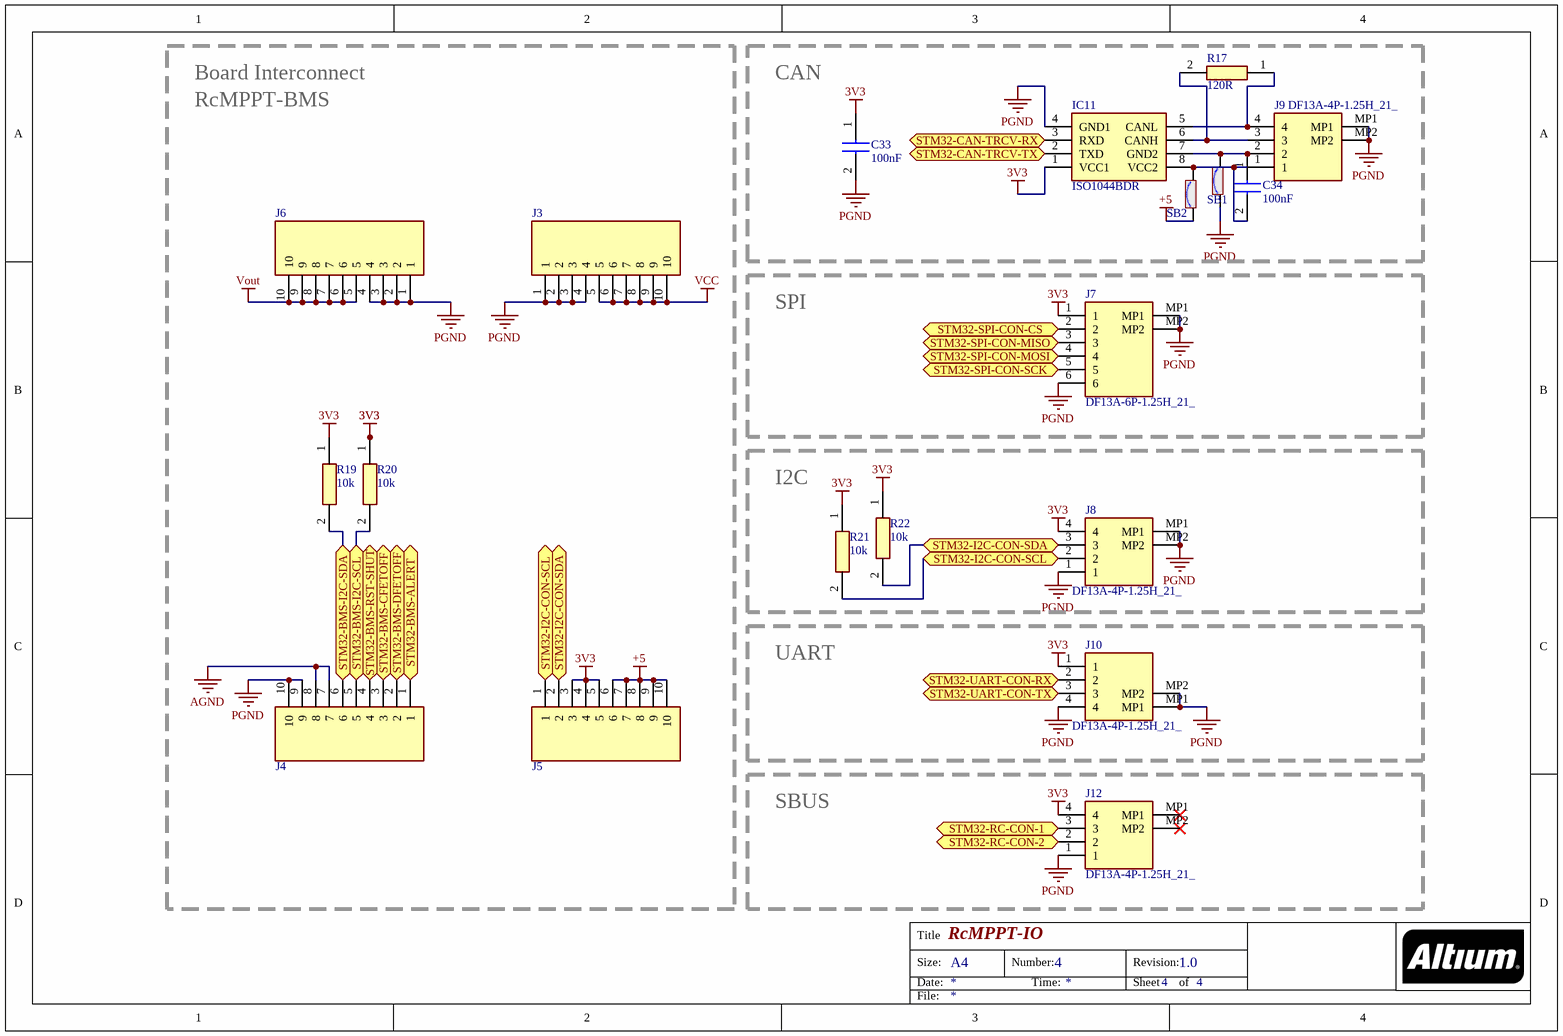
[diagram p3: RcMPPT-IO.SchDoc]

### Parts
C33  100nF  [CAPC1608X97N]
C34  100nF  [CAPC1608X97N]
IC11  ISO1044BDR  [SOIC127P600X175-8N]
J3  M52-040023V1045  [HDRV10W60P0X127_1X10_1270X250X250P]  (value not drawn)
J4  M52-040023V1045  [HDRV10W60P0X127_1X10_1270X250X250P]  (value not drawn)
J5  M52-040023V1045  [HDRV10W60P0X127_1X10_1270X250X250P]  (value not drawn)
J6  M52-040023V1045  [HDRV10W60P0X127_1X10_1270X250X250P]  (value not drawn)
J7  DF13A-6P-1.25H_21_  [DF13A6P125H21]
J8  DF13A-4P-1.25H_21_  [DF13A4P125H21]
J9  DF13A-4P-1.25H_21_  [DF13A4P125H21]
J10  DF13A-4P-1.25H_21_  [DF13A4P125H21]
J12  DF13A-4P-1.25H_21_  [DF13A4P125H21]
R17  120R  [RESC1608X55N]
R19  10k  [RESC1608X55N]
R20  10k  [RESC1608X55N]
R21  10k  [RESC1608X55N]
R22  10k  [RESC1608X55N]
SB1  Solder Bridge  [SOLDER-BRIDGE_R0603-0R]  (value not drawn)
SB2  Solder Bridge  [SOLDER-BRIDGE_R0603-0R]  (value not drawn)

### Blocks framed on the sheet
CAN: C33 C34 IC11 J9 R17 SB1 SB2
SPI: J7
I2C: J8 R21 R22
UART: J10
SBUS: J12

### Ports
STM32-BMS-ALERT (bidir), STM32-BMS-CFETOFF (bidir), STM32-BMS-DFETOFF (bidir), STM32-BMS-I2C-SCL (bidir), STM32-BMS-I2C-SDA (bidir), STM32-BMS-RST-SHUT (bidir), STM32-CAN-TRCV-RX (bidir), STM32-CAN-TRCV-TX (bidir), STM32-I2C-CON-SCL (bidir), STM32-I2C-CON-SDA (bidir), STM32-RC-CON-1 (bidir), STM32-RC-CON-2 (bidir), STM32-SPI-CON-CS (bidir), STM32-SPI-CON-MISO (bidir), STM32-SPI-CON-MOSI (bidir), STM32-SPI-CON-SCK (bidir), STM32-UART-CON-RX (bidir), STM32-UART-CON-TX (bidir)

### Nets
3V3: C33.1 IC11.1(VCC1) J5.3 J5.4 J5.5 J7.1 J8.4 J10.1 J12.4 R19.1 R20.1 R21.1 R22.1
+5: J5.6 J5.7 J5.8 J5.9 J5.10 SB2.1
AGND: J4.7 J4.8
PGND: C33.2 IC11.4(GND1) J3.1 J3.2 J3.3 J3.4 J4.9 J4.10 J6.1 J6.2 J6.3 J6.4 J7.6 J7.MP1 J7.MP2 J8.1 J8.MP1 J8.MP2 J9.MP1 J9.MP2 J10.4 J10.MP1 J10.MP2 J12.1 SB1.1
VCC: J3.5 J3.6 J3.7 J3.8 J3.9 J3.10
Vout: J6.5 J6.6 J6.7 J6.8 J6.9 J6.10
STM32-BMS-ALERT: J4.1 ; port STM32-BMS-ALERT
STM32-BMS-CFETOFF: J4.3 ; port STM32-BMS-CFETOFF
STM32-BMS-DFETOFF: J4.2 ; port STM32-BMS-DFETOFF
STM32-BMS-I2C-SCL: J4.5 R20.2 ; port STM32-BMS-I2C-SCL
STM32-BMS-I2C-SDA: J4.6 R19.2 ; port STM32-BMS-I2C-SDA
STM32-BMS-RST-SHUT: J4.4 ; port STM32-BMS-RST-SHUT
STM32-CAN-TRCV-RX: IC11.3(RXD) ; port STM32-CAN-TRCV-RX
STM32-CAN-TRCV-TX: IC11.2(TXD) ; port STM32-CAN-TRCV-TX
STM32-I2C-CON-SCL: J5.1 J8.2 R21.2 ; port STM32-I2C-CON-SCL
STM32-I2C-CON-SDA: J5.2 J8.3 R22.2 ; port STM32-I2C-CON-SDA
STM32-RC-CON-1: J12.3 ; port STM32-RC-CON-1
STM32-RC-CON-2: J12.2 ; port STM32-RC-CON-2
STM32-SPI-CON-CS: J7.2 ; port STM32-SPI-CON-CS
STM32-SPI-CON-MISO: J7.3 ; port STM32-SPI-CON-MISO
STM32-SPI-CON-MOSI: J7.4 ; port STM32-SPI-CON-MOSI
STM32-SPI-CON-SCK: J7.5 ; port STM32-SPI-CON-SCK
STM32-UART-CON-RX: J10.2 ; port STM32-UART-CON-RX
STM32-UART-CON-TX: J10.3 ; port STM32-UART-CON-TX
NetC34_1: C34.1 IC11.7(GND2) J9.2 SB1.2
NetC34_2: C34.2 IC11.8(VCC2) J9.1 SB2.2
NetIC11_5: IC11.5(CANL) J9.4 R17.1
NetIC11_6: IC11.6(CANH) J9.3 R17.2

Not connected (* = marked no-connect by the designer): J12 MP1* MP2*

### Notes on the sheet
- Board Interconnect
- RcMPPT-BMS
- Title
- Size:
- Date:
- A4
- Number:
- Time:
- Revision:
- Sheet
- of
- File:

### Library data of the parts
C33 C34 = VJ0603Y104JXJAC: Capacitor; Manufacturer_Name: Vishay; Datasheet Link: http://www.vishay.com/docs/45226/vj31xrohsautomlcc.pdf; Height: 0.97mm; Manufacturer_Part_Number: VJ0603Y104JXJAC; Mouser Part Number: 77-VJ0603Y104JXJAC; Mouser Price/Stock: https://www.mouser.com/Search/Refine.aspx?Keyword=77-VJ0603Y104JXJAC
IC11 = ISO1044BDR: Integrated Circuit; Manufacturer_Name: Texas Instruments; Datasheet Link: http://www.ti.com/lit/gpn/iso1044?HQS=ti-null-null-sf-df-pf-sep-wwe&DCM=yes; Height: 1.75mm; Manufacturer_Part_Number: ISO1044BDR; Mouser Part Number: 595-ISO1044BDR; Mouser Price/Stock: https://www.mouser.co.uk/ProductDetail/Texas-Instruments/ISO1044BDR/?qs=DuoOggApuK9UGD9QQWYeTA%3D%3D
J3-J6 = M52-040023V1045: Connector; Manufacturer_Name: Harwin; Datasheet Link: https://componentsearchengine.com/Datasheets/2/M52-040023V1045.pdf; Height: 2.5mm; Manufacturer_Part_Number: M52-040023V1045; Mouser Part Number: 855-M52-040023V1045; Mouser Price/Stock: https://www.mouser.co.uk/ProductDetail/Harwin/M52-040023V1045?qs=wuXwK9wHm9uI6z1%2FRhsKmg%3D%3D
J7 = DF13A-6P-1.25H_21_: Connector; Manufacturer_Name: Hirose; Manufacturer_Part_Number: DF13A-6P-1.25H(21); Datasheet Link: https://www.hirose.com/product/download/?distributor=digikey&type=2d&lang=en&num=DF13A-6P-1.25H(21); Height: 3.75mm; Mouser Part Number: 798-DF13A6P125H21; Mouser Price/Stock: https://www.mouser.co.uk/ProductDetail/Hirose-Connector/DF13A-6P-125H21?qs=XQjbzJWzFPXnreVi%252BPl0Lg%3D%3D; Arrow Part Number: DF13A-6P-1.25H(21); Arrow Price/Stock: https://www.arrow.com/en/products/df13a-6p-1.25h-21/hirose-electric
J8-J10 J12 = DF13A-4P-1.25H_21_: Connector; Manufacturer_Name: Hirose; Manufacturer_Part_Number: DF13A-4P-1.25H(21); Datasheet Link: https://componentsearchengine.com/Datasheets/1/DF13A-4P-1.25H(21).pdf; Height: 3.6mm; Mouser Part Number: 798-DF13A4P125H21; Mouser Price/Stock: https://www.mouser.co.uk/ProductDetail/Hirose-Connector/DF13A-4P-125H21?qs=XQjbzJWzFPXWzMShI70F0w%3D%3D
R17 = ERJPA3J121V: Resistor; Manufacturer_Name: Panasonic; Datasheet Link: https://industrial.panasonic.com/cdbs/www-data/pdf/RDA0000/AOA0000C243.pdf; Height: 0.55mm; Manufacturer_Part_Number: ERJPA3J121V
R19-R22 = MCT06030C1002FP500: Resistor; Manufacturer_Name: Vishay; Datasheet Link: http://www.vishay.com/docs/28705/mcx0x0xpro.pdf; Height: 0.55mm; Manufacturer_Part_Number: MCT06030C1002FP500; Mouser Part Number: 594-MCT06030C1002FP5; Mouser Price/Stock: https://www.mouser.co.uk/ProductDetail/Vishay-Beyschlag/MCT06030C1002FP500?qs=Wvg1umJc15zoHgIjwqoGHw%3D%3D
SB1 SB2 = Solder Bridge: Internal_Part_Number: MCD-00071; Part_Type: Mechanical; Manufacturer_Part_Number: RC0603JR-070RL; Manufacturer: YAGEO; Provided_By: SUBCO; ECCN_US: n/a; ECCN_EU: n/a; Status: Released; Package: SB0603; ComponentLink1Description: Datasheet; ComponentLink1URL: http://tunmcdsvn.tun.st.com/Component_Datasheet_Library/Trunk/Resistors/Yageo_Resistor_RC0603-series

## Nets that join several sheets
3V3: RcMPPT-MCU (15 pins), RcMPPT-Power_Module (C5.1 IC3.2 IC3.4), RcMPPT-DCDC (6 pins), RcMPPT-IO (13 pins)
+5: RcMPPT-MCU (D11.1), RcMPPT-Power_Module (12 pins), RcMPPT-DCDC (6 pins), RcMPPT-IO (6 pins)
AGND: RcMPPT-MCU (C7.2 MCU1.27), RcMPPT-Power_Module (11 pins), RcMPPT-DCDC (12 pins), RcMPPT-IO (J4.7 J4.8)
PGND: RcMPPT-MCU (26 pins), RcMPPT-Power_Module (13 pins), RcMPPT-DCDC (18 pins), RcMPPT-IO (25 pins)
VCC: RcMPPT-DCDC (P2.1 R11.4 R14.2), RcMPPT-IO (6 pins)
Vout: RcMPPT-Power_Module (7 pins), RcMPPT-DCDC (P1.1 R12.2 R18.1), RcMPPT-IO (6 pins)
BOOST-BIN: RcMPPT-MCU (MCU1.41), RcMPPT-DCDC (IC5.2)
BOOST-TIN: RcMPPT-MCU (MCU1.40), RcMPPT-DCDC (IC5.1)
BUCK-BIN: RcMPPT-MCU (MCU1.39), RcMPPT-DCDC (IC4.2)
BUCK-TIN: RcMPPT-MCU (MCU1.38), RcMPPT-DCDC (IC4.1)
STM32-ADC1: RcMPPT-MCU (MCU1.9), RcMPPT-DCDC (C36.2 R10.1)
STM32-ADC2: RcMPPT-MCU (MCU1.8), RcMPPT-DCDC (C38.2 D10.3 R14.1 R16.2)
STM32-ADC3: RcMPPT-MCU (MCU1.10), RcMPPT-DCDC (C37.2 D9.3 R12.1 R15.2)
STM32-ADC4: RcMPPT-MCU (MCU1.11), RcMPPT-DCDC (C35.2 R9.1)
STM32-BMS-ALERT: RcMPPT-MCU (MCU1.18), RcMPPT-IO (J4.1)
STM32-BMS-CFETOFF: RcMPPT-MCU (MCU1.20), RcMPPT-IO (J4.3)
STM32-BMS-DFETOFF: RcMPPT-MCU (MCU1.19), RcMPPT-IO (J4.2)
STM32-BMS-I2C-SCL: RcMPPT-MCU (MCU1.22), RcMPPT-IO (J4.5 R20.2)
STM32-BMS-I2C-SDA: RcMPPT-MCU (MCU1.42), RcMPPT-IO (J4.6 R19.2)
STM32-BMS-RST-SHUT: RcMPPT-MCU (MCU1.21), RcMPPT-IO (J4.4)
STM32-CAN-TRCV-RX: RcMPPT-MCU (MCU1.34), RcMPPT-IO (IC11.3)
STM32-CAN-TRCV-TX: RcMPPT-MCU (MCU1.35), RcMPPT-IO (IC11.2)
STM32-I2C-CON-SCL: RcMPPT-MCU (MCU1.51), RcMPPT-IO (J5.1 J8.2 R21.2)
STM32-I2C-CON-SDA: RcMPPT-MCU (MCU1.60), RcMPPT-IO (J5.2 J8.3 R22.2)
STM32-RC-CON-1: RcMPPT-MCU (MCU1.44), RcMPPT-IO (J12.3)
STM32-RC-CON-2: RcMPPT-MCU (MCU1.25), RcMPPT-IO (J12.2)
STM32-SPI-CON-CS: RcMPPT-MCU (MCU1.62), RcMPPT-IO (J7.2)
STM32-SPI-CON-MISO: RcMPPT-MCU (MCU1.53), RcMPPT-IO (J7.3)
STM32-SPI-CON-MOSI: RcMPPT-MCU (MCU1.58), RcMPPT-IO (J7.4)
STM32-SPI-CON-SCK: RcMPPT-MCU (MCU1.52), RcMPPT-IO (J7.5)
STM32-UART-CON-RX: RcMPPT-MCU (MCU1.55), RcMPPT-IO (J10.2)
STM32-UART-CON-TX: RcMPPT-MCU (MCU1.54), RcMPPT-IO (J10.3)